# EasyEDA schematic Cokpit V3- AutoPilot.json
TITLE: AutoPilot; REV: 1.0; Date: 2021-01-01; Sheet: 1/1; Company: Open source MIT licence
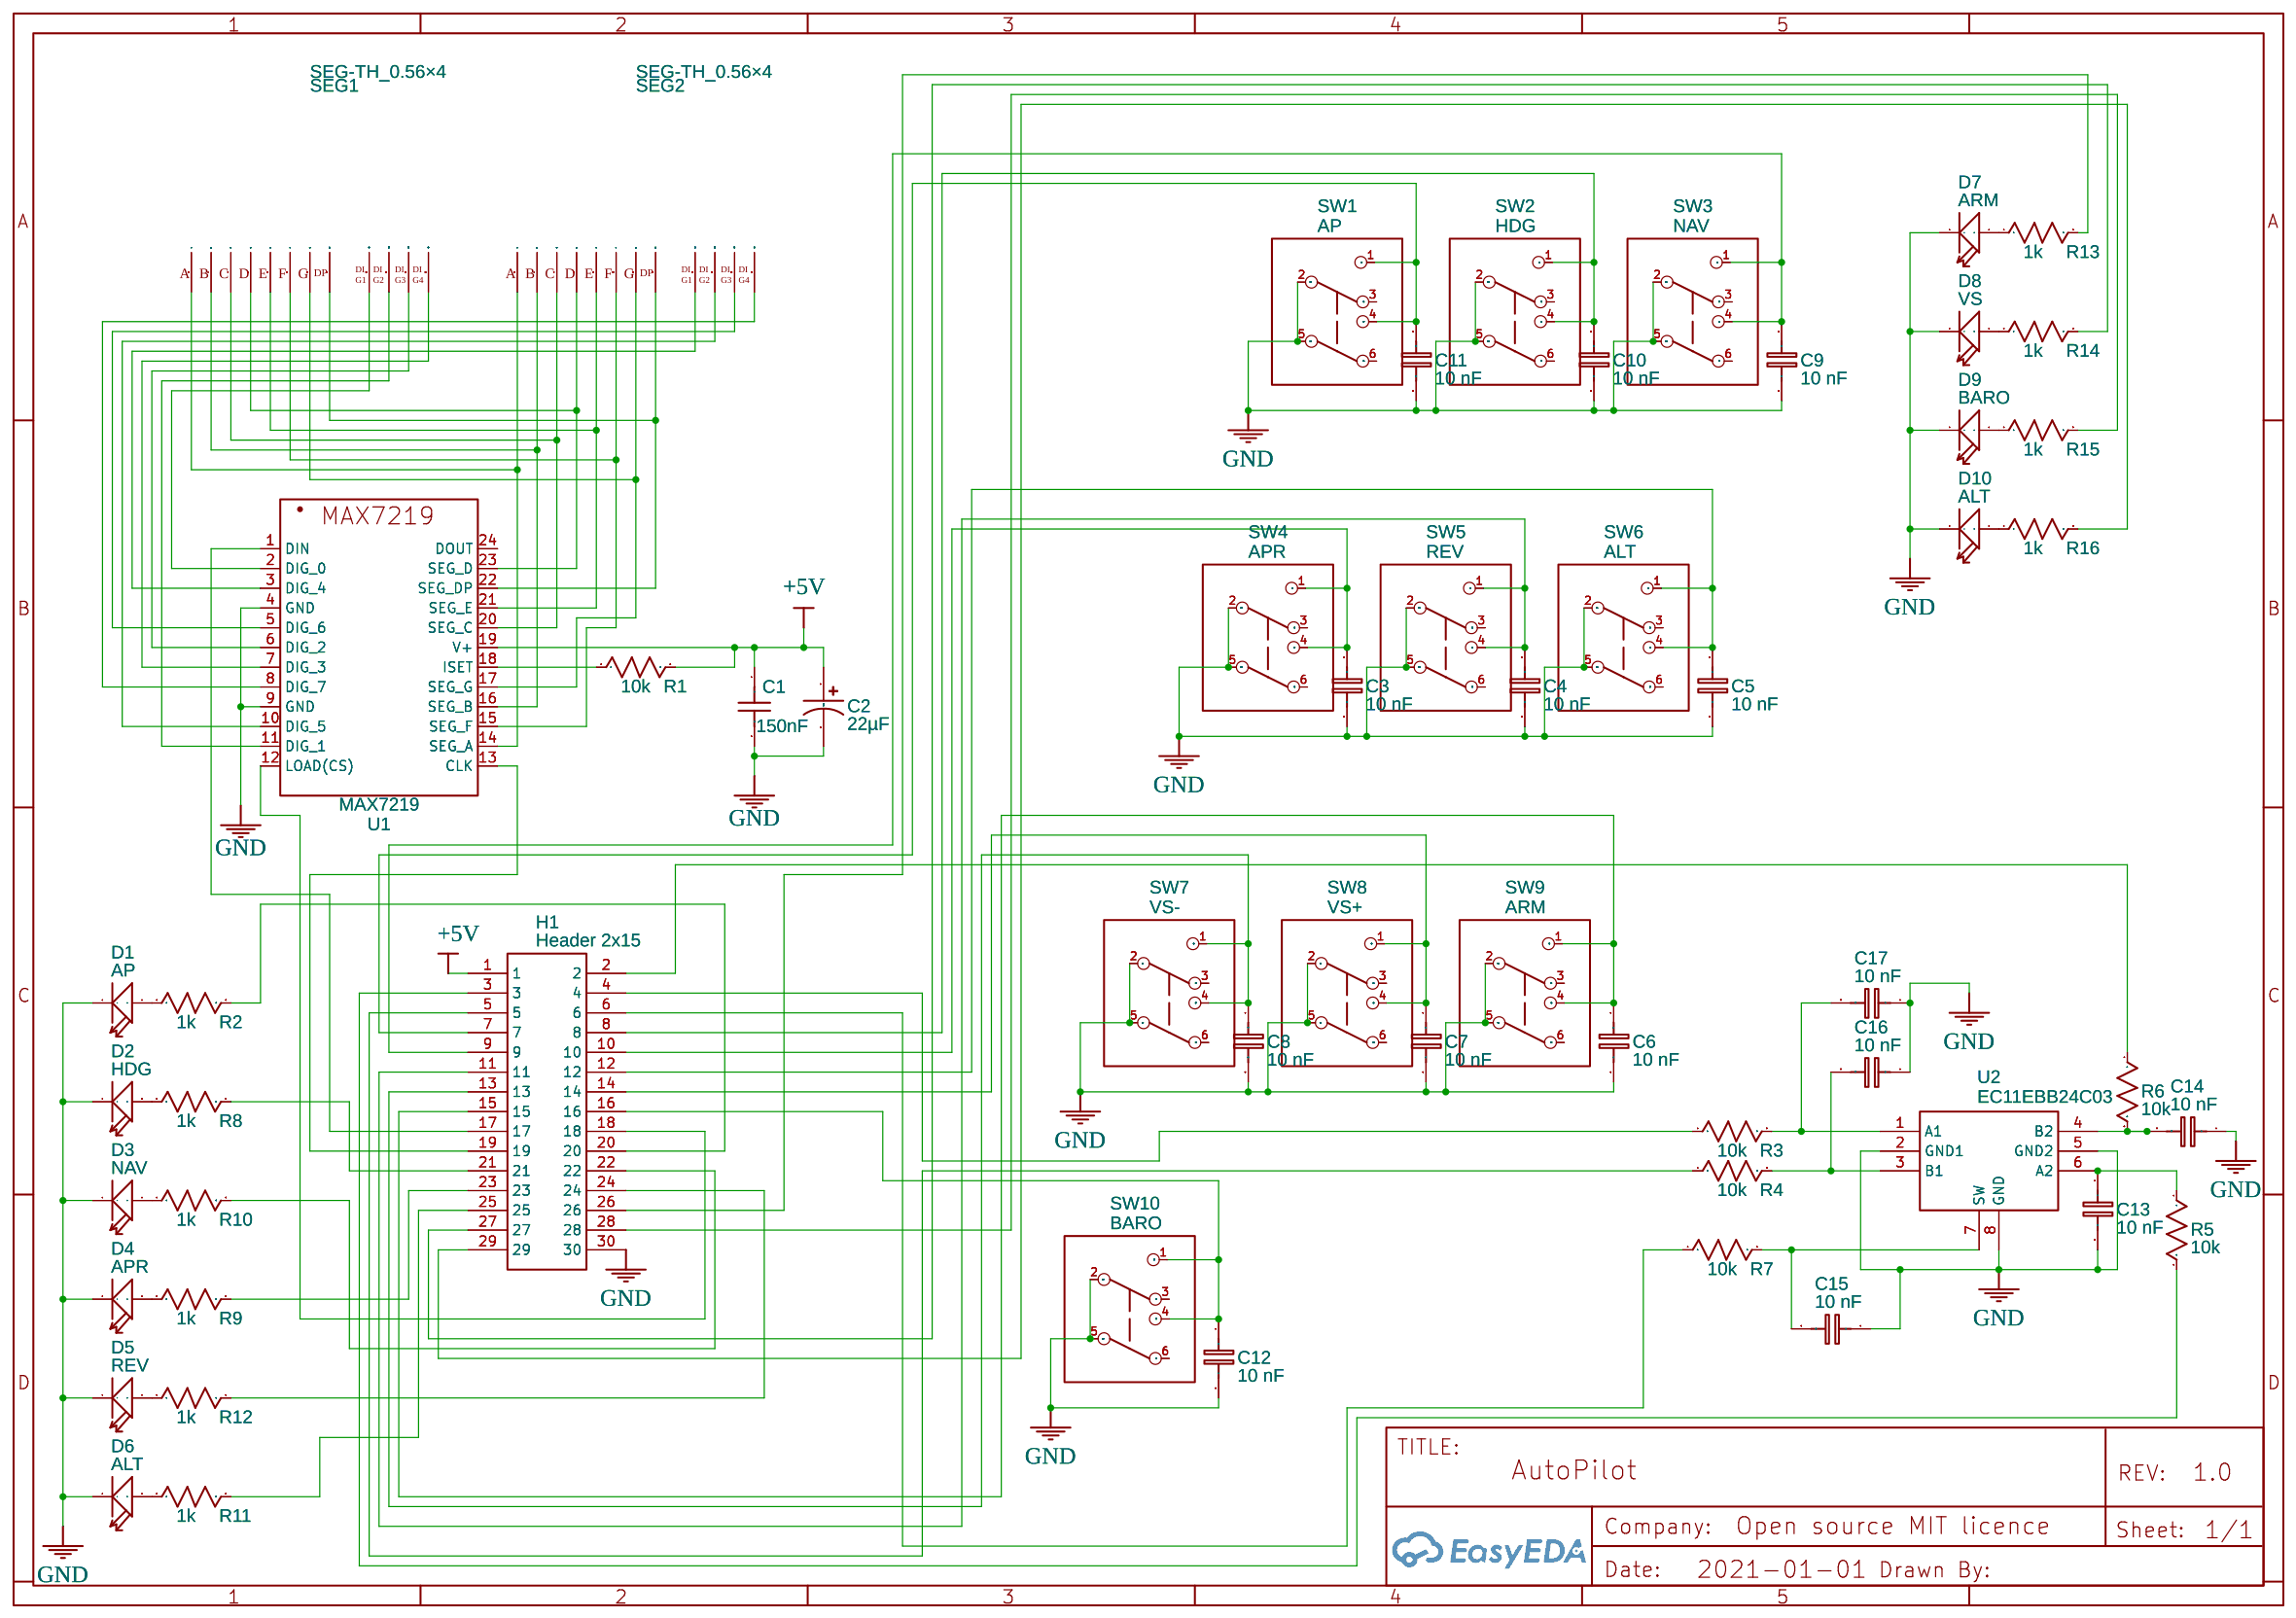
[diagram p0: schematic sheet]

## Parts
C1  150nF  [CONDENSATEUR]
C2  22µF  [CONDENSATEUR]
C3  10 nF  [RAD-0.1]
C4  10 nF  [RAD-0.1]
C5  10 nF  [RAD-0.1]
C6  10 nF  [RAD-0.1]
C7  10 nF  [RAD-0.1]
C8  10 nF  [RAD-0.1]
C9  10 nF  [RAD-0.1]
C10  10 nF  [RAD-0.1]
C11  10 nF  [RAD-0.1]
C12  10 nF  [RAD-0.1]
C13  10 nF  [RAD-0.1]
C14  10 nF  [RAD-0.1]
C15  10 nF  [RAD-0.1]
C16  10 nF  [RAD-0.1]
C17  10 nF  [RAD-0.1]
D1  AP  [LED2-2.54-D3.0MM]
D2  HDG  [LED2-2.54-D3.0MM]
D3  NAV  [LED2-2.54-D3.0MM]
D4  APR  [LED2-2.54-D3.0MM]
D5  REV  [LED2-2.54-D3.0MM]
D6  ALT  [LED2-2.54-D3.0MM]
D7  ARM  [LED2-2.54-D3.0MM]
D8  VS  [LED2-2.54-D3.0MM]
D9  BARO  [LED2-2.54-D3.0MM]
D10  ALT  [LED2-2.54-D3.0MM]
H1  Header 2x15  [HDR-M-2.54_2X15]
R1  10k  [RESISTANCE]
R2  1k  [RESISTANCE]
R3  10k  [RESISTANCE]
R4  10k  [RESISTANCE]
R5  10k  [RESISTANCE]
R6  10k  [RESISTANCE]
R7  10k  [RESISTANCE]
R8  1k  [RESISTANCE]
R9  1k  [RESISTANCE]
R10  1k  [RESISTANCE]
R11  1k  [RESISTANCE]
R12  1k  [RESISTANCE]
R13  1k  [RESISTANCE]
R14  1k  [RESISTANCE]
R15  1k  [RESISTANCE]
R16  1k  [RESISTANCE]
SEG1  SEG-TH_0.56×4  [LED-SEG-TH_12P-L30.0-W14.0-P2.54-S10.16-BL]
SEG2  SEG-TH_0.56×4  [LED-SEG-TH_12P-L30.0-W14.0-P2.54-S10.16-BL]
SW1  AP  [SW_PUSH_BUTTON_MINI_7X7MM]
SW2  HDG  [SW_PUSH_BUTTON_MINI_7X7MM]
SW3  NAV  [SW_PUSH_BUTTON_MINI_7X7MM]
SW4  APR  [SW_PUSH_BUTTON_MINI_7X7MM]
SW5  REV  [SW_PUSH_BUTTON_MINI_7X7MM]
SW6  ALT  [SW_PUSH_BUTTON_MINI_7X7MM]
SW7  VS-  [SW_PUSH_BUTTON_MINI_7X7MM]
SW8  VS+  [SW_PUSH_BUTTON_MINI_7X7MM]
SW9  ARM  [SW_PUSH_BUTTON_MINI_7X7MM]
SW10  BARO  [SW_PUSH_BUTTON_MINI_7X7MM]
U1  MAX7219  [MAX7219_DIP-24]
U2  EC11EBB24C03  [DUAL ENCODER W/CLICK]

## Library data of the parts
C1 = C_0201_US: Contributor: LCEDA_Lib
C2 = C_Tan_SMD_A_US: Contributor: LCEDA_Lib
C3-C17 = Capacitor1_EU: Contributor: EasyEDA; Capacitance: 1u; sim: true
D1-D10 = DIP LED Red-Red;: Manufacturer Part: ?
H1 = Header 2x15: link: https://www.aliexpress.com/item/32772785817.html?spm=a2g0s.8937460.0.0.267f2e0enxGmWw; Contributor: darmayuda.b.ariston; Package Display: No
R1-R16 = R_0201_US: Contributor: LCEDA_Lib; Package Display: No
SEG1 SEG2 = SEG-TH_0.56×4: Manufacturer: 方舟 ARKLED; Supplier Part: C109200; Contributor: LCEDA_01
SW1-SW10 = SW_PUSH_DPDT_MINI_7x7: Contributor: Sikander
U1 = MAX7219: Supplier: LCSC; Manufacturer: DIODES; Manufacturer Part: MAXIM; Supplier Part: C129565; Contributor: phamhai
U2 = EC11EBB24C03: Contributor: dotsha747; link: https://www.alps.com/prod/info/E/HTML/Encoder/Incremental/EC11/EC11EBB24C03.html

## Nets
+5V: C1.1 C2.1 H1.1 R1.2 U1.19(V+)
GND: C1.2 C2.2 C3.2 C4.2 C5.2 C6.2 C7.2 C8.2 C9.2 C10.2 C11.2 C12.2 C13.2 C14.1 C15.1 C16.1 C17.1 D1.K(-) D2.K(-) D3.K(-) D4.K(-) D5.K(-) D6.K(-) D7.K(-) D8.K(-) D9.K(-) D10.K(-) H1.30 SW1.2(COM1) SW1.5(COM2) SW2.2(COM1) SW2.5(COM2) SW3.2(COM1) SW3.5(COM2) SW4.2(COM1) SW4.5(COM2) SW5.2(COM1) SW5.5(COM2) SW6.2(COM1) SW6.5(COM2) SW7.2(COM1) SW7.5(COM2) SW8.2(COM1) SW8.5(COM2) SW9.2(COM1) SW9.5(COM2) SW10.2(COM1) SW10.5(COM2) U1.4(GND) U1.9(GND) U2.2(GND1) U2.5(GND2) U2.8(GND)
Net-(C3-1): C3.1 H1.10 SW4.1(NO1) SW4.4(NO2)
Net-(C4-1): C4.1 H1.11 SW5.1(NO1) SW5.4(NO2)
Net-(C5-1): C5.1 H1.12 SW6.1(NO1) SW6.4(NO2)
Net-(C6-1): C6.1 H1.15 SW9.1(NO1) SW9.4(NO2)
Net-(C7-1): C7.1 H1.14 SW8.1(NO1) SW8.4(NO2)
Net-(C8-1): C8.1 H1.13 SW7.1(NO1) SW7.4(NO2)
Net-(C9-1): C9.1 H1.9 SW3.1(NO1) SW3.4(NO2)
Net-(C10-1): C10.1 H1.8 SW2.1(NO1) SW2.4(NO2)
Net-(C11-1): C11.1 H1.7 SW1.1(NO1) SW1.4(NO2)
Net-(C12-1): C12.1 H1.16 SW10.1(NO1) SW10.4(NO2)
Net-(C13-1): C13.1 R5.1 U2.6(A2)
Net-(C14-2): C14.2 R6.2 U2.4(B2)
Net-(C15-2): C15.2 R7.2 U2.7(SW)
Net-(C16-2): C16.2 R4.2 U2.3(B1)
Net-(C17-2): C17.2 R3.2 U2.1(A1)
Net-(D1-A): D1.A(+) R2.1
Net-(D2-A): D2.A(+) R8.1
Net-(D3-A): D3.A(+) R10.1
Net-(D4-A): D4.A(+) R9.1
Net-(D5-A): D5.A(+) R12.1
Net-(D6-A): D6.A(+) R11.1
Net-(D7-A): D7.A(+) R13.1
Net-(D8-A): D8.A(+) R14.1
Net-(D9-A): D9.A(+) R15.1
Net-(D10-A): D10.A(+) R16.1
Net-(H1-2): H1.2 R6.1
Net-(H1-3): H1.3 R5.2
Net-(H1-4): H1.4 R3.1
Net-(H1-5): H1.5 R4.1
Net-(H1-6): H1.6 R7.1
Net-(H1-17): H1.17 U1.1(DIN)
Net-(H1-18): H1.18 U1.12(LOAD(CS))
Net-(H1-19): H1.19 U1.13(CLK)
Net-(H1-20): H1.20 R2.2
Net-(H1-21): H1.21 R8.2
Net-(H1-22): H1.22 R10.2
Net-(H1-23): H1.23 R9.2
Net-(H1-24): H1.24 R12.2
Net-(H1-25): H1.25 R11.2
Net-(H1-26): H1.26 R13.2
Net-(H1-27): H1.27 R14.2
Net-(H1-28): H1.28 R15.2
Net-(H1-29): H1.29 R16.2
Net-(R1-1): R1.1 U1.18(ISET)
Net-(SEG1-1): SEG1.1(E) SEG2.1(E) U1.21(SEG E)
Net-(SEG1-2): SEG1.2(D) SEG2.2(D) U1.23(SEG D)
Net-(SEG1-3): SEG1.3(DP) SEG2.3(DP) U1.22(SEG DP)
Net-(SEG1-4): SEG1.4(C) SEG2.4(C) U1.20(SEG C)
Net-(SEG1-5): SEG1.5(G) SEG2.5(G) U1.17(SEG G)
Net-(SEG1-6): SEG1.6(DIG4) U1.7(DIG 3)
Net-(SEG1-7): SEG1.7(B) SEG2.7(B) U1.16(SEG B)
Net-(SEG1-8): SEG1.8(DIG3) U1.6(DIG 2)
Net-(SEG1-9): SEG1.9(DIG2) U1.11(DIG 1)
Net-(SEG1-10): SEG1.10(F) SEG2.10(F) U1.15(SEG F)
Net-(SEG1-11): SEG1.11(A) SEG2.11(A) U1.14(SEG A)
Net-(SEG1-12): SEG1.12(DIG1) U1.2(DIG 0)
Net-(SEG2-6): SEG2.6(DIG4) U1.8(DIG 7)
Net-(SEG2-8): SEG2.8(DIG3) U1.5(DIG 6)
Net-(SEG2-9): SEG2.9(DIG2) U1.10(DIG 5)
Net-(SEG2-12): SEG2.12(DIG1) U1.3(DIG 4)

Not connected (* = marked no-connect by the designer): SW1 3(NC1) 6(NC2); SW2 3(NC1) 6(NC2); SW3 3(NC1) 6(NC2); SW4 3(NC1) 6(NC2); SW5 3(NC1) 6(NC2); SW6 3(NC1) 6(NC2); SW7 3(NC1) 6(NC2); SW8 3(NC1) 6(NC2); SW9 3(NC1) 6(NC2); SW10 3(NC1) 6(NC2); U1 24(DOUT)
